# EAGLE design ledstringpower2 (EAGLE 9.2.2)
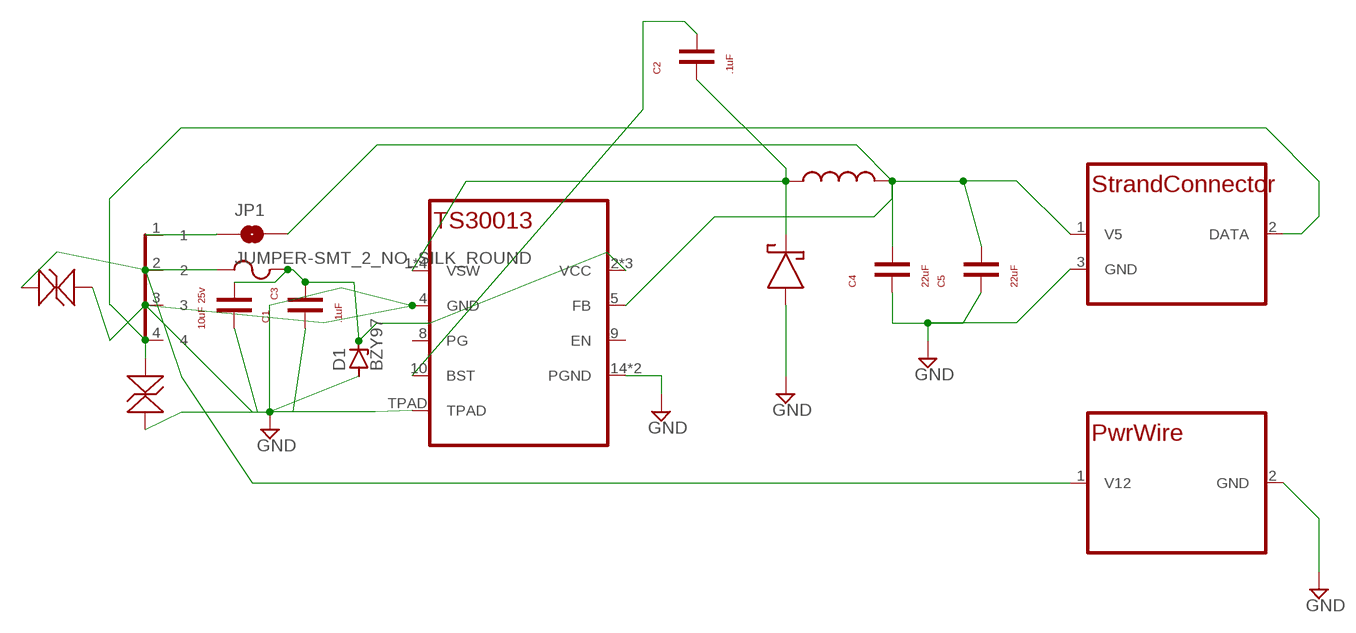
[diagram p0: schematic, sheet 1]

## Parts
C1  .1uF  CAPACITOR_NONPOLARC0603  [C0603]
C2  .1uF  CAPACITOR_NONPOLARC0603  [C0603]
C3  10uF 25v  CL31A106MAHNNNEC1206  [C1206]
C4  22uF  GRM188R61A226ME15DC0603  [C0603]
C5  22uF  GRM188R61A226ME15DC0603  [C0603]
D1  BZY97  [F126Z12]
D2  LS54LS54  [LS54]
F1  3A  FUSER0603  [R0603]
IC1  TS30013QFN16  [QFN16]
JP1  JUMPER-SMT_2_NO_SILK_ROUND  [SMT-JUMPER_2_NO_SILK_ROUND]
L1  SRN5040TA-4R7MSRN5040TA  [SRN5040TA]
TVS1  DESD5V0U1BL-7BDFN1006-2  [DFN1006-2]
TVS2  DESD5V0U1BL-7BDFN1006-2  [DFN1006-2]
U$3  TE-1969806-1TE-1969806-1  [TE-1969806-1]
U$5  LEDSTRANDDLEDWIREP  [LEDWIREP]
U$8  PWRWIREDPWRWIREP  [PWRWIREP]

## Nets
DATA: TVS2.2 U$3.4 U$5.2(DATA)
GND: C1.1 C3.2 C4.1 C5.1 D1.A D2.1 IC1.4(GND) IC1.14(PGND) IC1.15(PGND) IC1.TPAD TVS1.1 TVS2.1 U$3.3 U$5.3(GND) U$8.2(GND)
N$3: C2.1 D2.2 IC1.1(VSW) IC1.12(VSW) IC1.13(VSW) IC1.16(VSW) L1.1
N$5: C2.2 IC1.10(BST)
N$7: JP1.1 U$3.1
V5: C4.2 C5.2 IC1.5(FB) JP1.2 L1.2 U$5.1(V5)
V12: F1.1 TVS1.2 U$3.2 U$8.1(V12)
VCC: C1.2 C3.1 D1.C F1.2 IC1.2(VCC) IC1.3(VCC) IC1.11(VCC)
Unconnected: IC1.8(PG) IC1.9(EN)

## Library data of the parts
C1 C2 = ledinlinesupply:CAPACITOR_NONPOLAR
C3 = ledinlinesupply:CL31A106MAHNNNE
C4 C5 = ledinlinesupply:GRM188R61A226ME15D
D1 = diode:BZY97: Z DIODE
D2 = ledinlinesupply:LS54
F1 = ledinlinesupply:FUSE
IC1 = ledinlinesupply:TS30013
JP1 = SparkFun-Jumpers:JUMPER-SMT_2_NO: Normally open jumper This jumper has two pads in close proximity to each other. Apply solder to close the connection. Round pads are easier to solder for beginners, but are a lot larger. SparkFun Product that uses the round pads: SparkFun EL Sequencer <https://www.sparkfun.com/products/12781>
L1 = ledinlinesupply:SRN5040TA-4R7M
TVS1 TVS2 = ledinlinesupply:DESD5V0U1BL-7B
U$3 = ledinlinesupply:TE-1969806-1
U$5 = ledinlinesupply:LEDSTRANDD
U$8 = ledinlinesupply:PWRWIRED

## Board
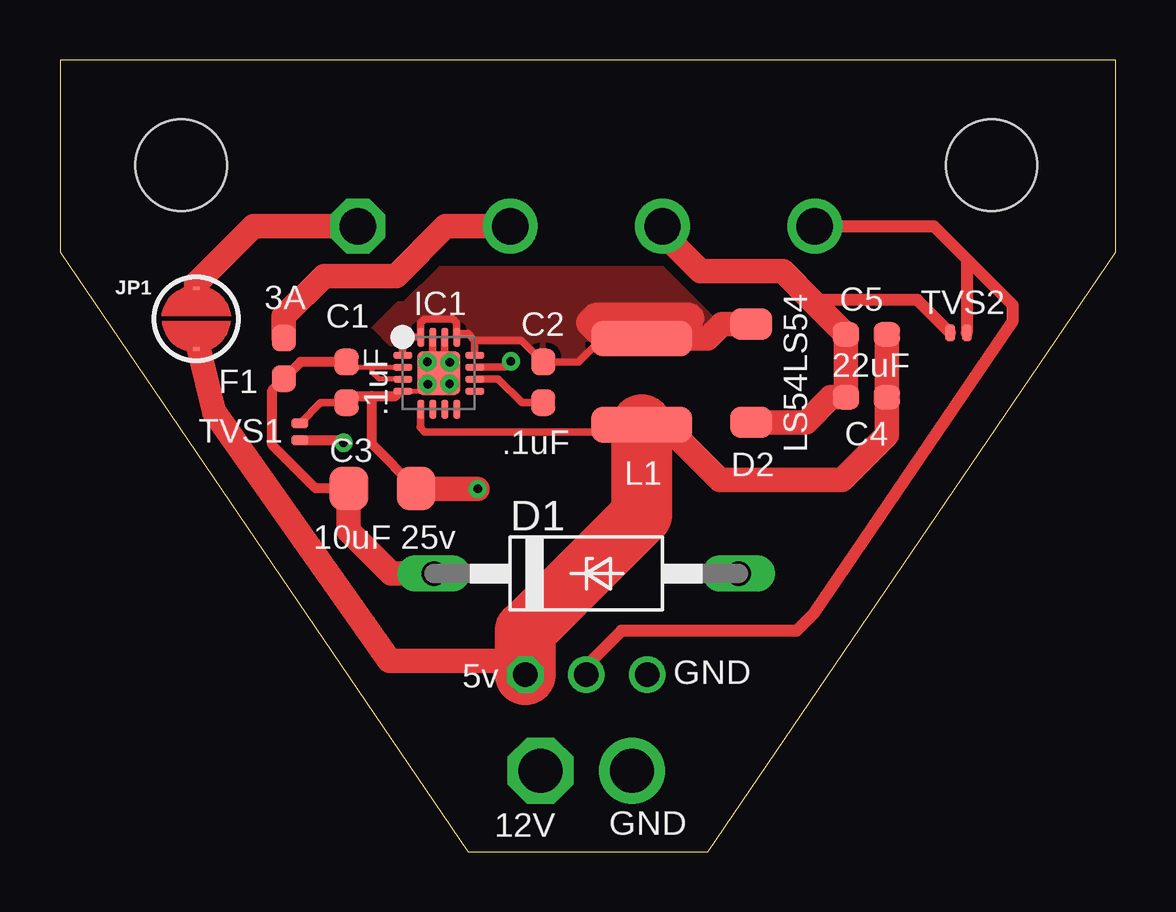
[diagram p1: board, top side]
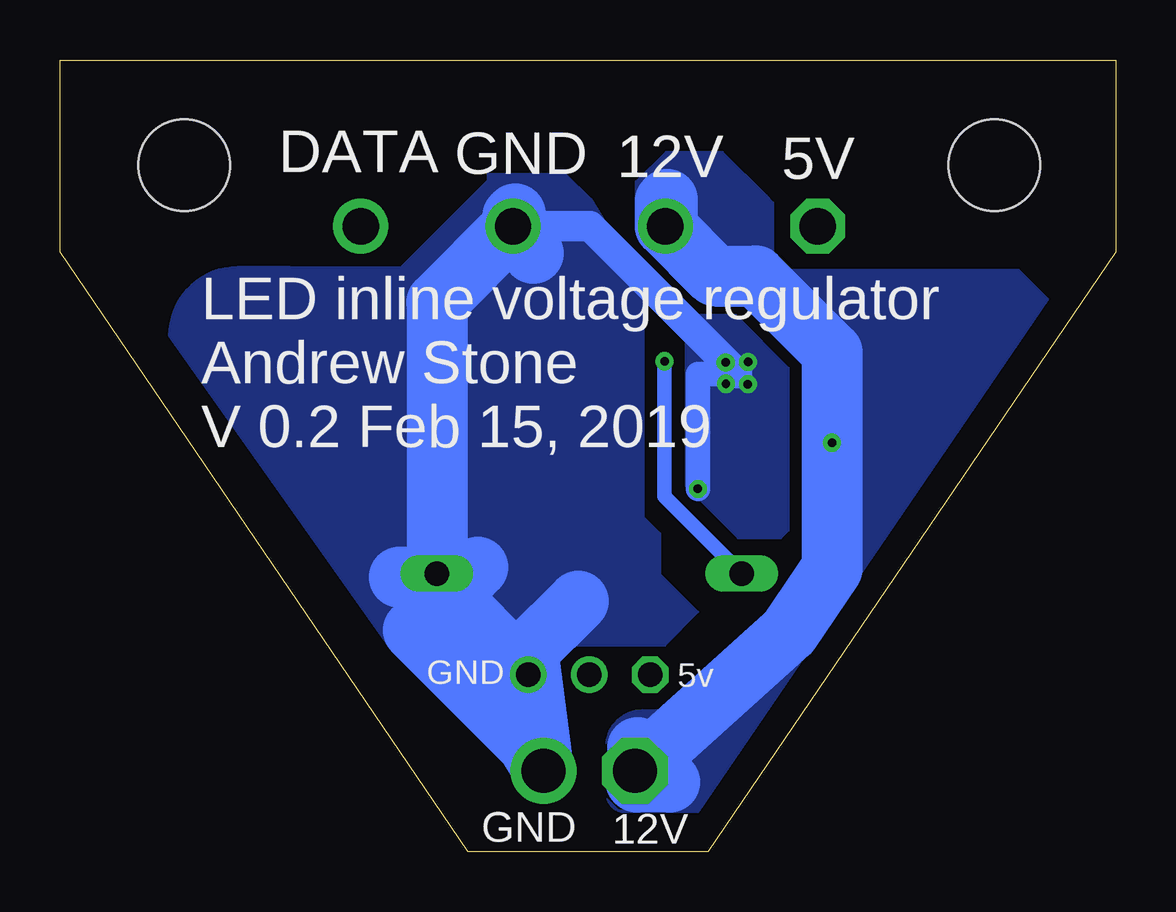
[diagram p2: board, bottom side, seen from below]

Size 44 x 33 mm. Coordinates in mm from the lower left corner, seen from the top.
Outline: 17,0 27,0 44,25 44,33 0,33 0,25 17,0
Copper layers (1*16): Top 0.035mm / dielectric 1.5mm / Bottom 0.035mm
Design rules "default *": minimum track width 6mil, minimum drill 0.35mm, track to track 6mil, track to pad 6mil, pad to pad 6mil, via to via 6mil, smd to smd 6mil, copper to edge 40mil, drill to drill 6mil, minimum pad ring 10mil, minimum via ring 8mil, stop-mask expansion 0.4mm, vias tented up to drill 0mil, thermal gap 10mil

### Footprints (pad centres in the part's own frame; a part is rotated, then mirrored left to right if it is on the bottom)
C0603 = smd 1.1 x 1: 1 -0.85,0; 2 0.85,0
C1206 = smd 1.6 x 1.8: 1 -1.4,0; 2 1.4,0
F126Z12 = drill 1.016 long: A 6.35,0; C -6.35,0
LS54 = smd 1.3 x 1.75: 1 -2.05,0; 2 2.05,0
R0603 = smd 1.1 x 1: 1 -0.85,0; 2 0.85,0
QFN16 = smd 0.8 x 0.3: 1 -1.5,0.75; 2 -1.5,0.25; 3 -1.5,-0.25; 4 -1.5,-0.75; 9 1.5,-0.75; 10 1.5,-0.25; 11 1.5,0.25; 12 1.5,0.75 | smd 0.3 x 0.8: 5 -0.75,-1.5; 6 -0.25,-1.5; 7 0.25,-1.5; 8 0.75,-1.5; 13 0.75,1.5; 14 0.25,1.5; 15 -0.25,1.5; 16 -0.75,1.5 | smd 1.8 x 1.8: TPAD 0,0
SMT-JUMPER_2_NO_SILK_ROUND = smd 0.152 x 0.305: 1 -1.27,0; 2 1.27,0
SRN5040TA = smd 1.5 x 4.2: 1 -1.8,0; 2 1.8,0
DFN1006-2 = smd 0.4 x 0.7: 1 -0.35,0; 2 0.35,0
TE-1969806-1 = drill 1.52 octagon: 1 -9.525,0 | drill 1.52: 2 -3.175,0; 3 3.175,0; 4 9.525,0 | hole 3.81: -16.89,2.54; 16.89,2.54
LEDWIREP = drill 1.016 octagon: 1 -2.54,0 | drill 1.016: 2 0,0; 3 2.54,0
PWRWIREP = drill 1.829 octagon: 1 -1.905,0 | drill 1.829: 2 1.905,0

### Placement (x,y rotation side)
C1  11.95,19.56 90 top
C2  20.14,19.56 270 top
C3  13.44,15.14 0 top
C4  33.62,18.94 0 top
C5  33.62,21.56 0 top
D1  21.94,11.59 0 top
D2  28.82,19.94 90 top
F1  9.33,20.56 270 top
IC1  15.79,19.94 0 top
JP1  5.68,22.21 270 top
L1  24.25,19.59 270 top
TVS1  10,17.5 270 top
TVS2  37.45,21.63 0 top
U$3  21.94,26.07 0 top
U$5  21.94,7.37 0 top
U$8  21.94,3.37 0 top

### Tracks (layer width: path | path; a pad name or v marks a point on that pad's centre or on a via)
DATA
  Top 0.508: U$3.4 36.43,26.07 37.8,24.7 | 37.8,24.7 TVS2.2 | 37.8,24.7 39.7,22.8 39.7,22.1 31.41,9.91 30.7,9.2 23.4,9.2 21.94,7.74 U$5.2
GND  (via drill 0.35)
  Top 0.2: 14,19 14.1,19 IC1.4 arc-90 IC1.4 15.3,19.2 arc90 15.79,19.69 15.79,19.9
  Top 0.305: C1.1 10.86,18.71 TVS1.1 | IC1.14 16.04,20.56 v16.25,20.39 | IC1.15 15.54,20.64 v15.32,20.41
  Top 0.406: C1.1 12.24,19 13,19 | 13,19 14,19 | C3.2 13,16.98 13,19 | IC1.TPAD 16.3,20.39 v16.25,20.39 | v16.24,19.5 15.84,19.9 15.79,19.9 | v15.33,19.49 v15.32,19.49 v15.32,20.41
  Top 0.508: 31.41,22.91 31.49,22.99 35.74,22.99 TVS2.1
  Top 1.016: D2.1 31.09,17.89 32.14,18.94 C4.1 C5.1 31.41,22.91 30.12,24.2 26.7,24.2 25.12,25.78 U$3.3 | v17.41,15.12 14.84,15.12 C3.2
  Bottom 0.406: v16.25,20.39 IC1.TPAD 15.33,19.53 v15.33,19.49 | v16.24,19.5 15.82,19.91 15.35,20.37 v15.32,20.41
  Bottom 1.016: 15.82,19.91 17.41,19.91 v17.41,15.12
  Bottom 1.27: IC1.TPAD 21.9,26.07 U$3.3
  Bottom 2.54: D1.A 28.29,22.9 U$3.3 25.12,26.48 25.02,26.58 25.02,25.68 24.27,24.93 | D1.A 28.29,11.18 U$5.3 U$8.2 | D1.A 26.86,11.59 | 26.86,11.59 26.59,11.86 | 26.86,11.59 27.02,11.43 29.85,11.43 | U$8.2 24.48,4.42 29.28,9.22 | U$8.2 24.48,8.34 22.39,10.43
  pour Bottom: 17.98,22.36 15.83,22.36 13.63,20.16 13.63,13.39 13.94,13.08 15.75,13.08 17.9,15.23 17.9,21.84 17.4,22.34 17.41,22.34
  pour Bottom: 19.68,23.6 19.68,13.94 19,13.26 19,11.58 17.4,9.98 18.79,8.59 30.31,8.59 39.44,21.51 arc90 36.59,24.36 34.43,24.36 arc-90 34.41,24.34 29.8,24.34 26.16,27.98 26.16,28.24 22.92,28.24 21.87,27.19
N$3
  Top 0.305: IC1.1 14.29,21.29 14.5,21.5 14.56,21.44 IC1.16 15.04,22.04 15.2,22.2 16.38,22.2 16.54,22.04 16.54,21.6 | 16.54,21.6 IC1.13 | IC1.12 17.29,21.31 | 16.54,21.6 17,21.6 17.29,21.31 | 17.29,21.31 19.24,21.31 C2.1 21.61,20.41 22.59,21.39 L1.1
  Top 1.016: D2.2 27.59,21.99 26.99,21.39 L1.1
  Top 1.27: L1.1 22.83,21.39 22.16,22.06 22.34,22.24 26.21,22.24
  pour Top: 14.18,21.04 13.83,21.04 13.03,21.84 14.07,22.88 14.33,22.88 15.82,24.37 25.13,24.37 27.26,22.24 27.26,22.04 26.72,21.5 22.57,21.5 21.53,20.46 20.12,20.46 19.33,21.25 19.11,21.25 19.04,21.32 17.22,21.32 16.28,22.26 15.32,22.26 14.96,21.9 14.96,21.56 14.8,21.4 14.32,21.4 14.23,21.31 14.23,21.17
N$5
  Top 0.305: C2.2 19.25,18.71 18.27,19.69 18,19.69 17.85,19.69 IC1.10
N$7
  Top 1.016: U$3.1 8.07,26.07 5.68,23.68 JP1.1
V5
  Top 0.152: JP1.2 5.77,20.98 | 18.27,9.71 19.4,9.2
  Top 0.305: IC1.5 15.04,17.74 15,17.7 15.2,17.5 23.96,17.5 L1.2
  Top 1.016: L1.2 25.21,17.79 27.5,15.5 32.6,15.5 34.47,17.36 C4.2 C5.2 | 5.77,20.98 6.43,18.33 13.74,7.94 18.83,7.94 arc-90 U$5.1
  Top 2.54: U$5.1 19.4,9.2 24.25,14.05 L1.2
V12  (via drill 0.35)
  Top 0.406: TVS1.2 11.71,17.15 v11.82,17.04
  Top 1.016: U$3.2 16.07,26.07 14,24 11,24 9.33,22.33 F1.1
  Bottom 2.54: U$3.2 16.7,24 15,24 11.82,20.82 v11.82,17.04 11.82,11.79 13.61,9.16 U$8.1 19.06,3.37 18.59,2.9 19.95,2.9 19.99,2.94 19.91,3.02 19.91,4.34 | U$3.2 18.77,27.1 18.68,27.19 18.68,26.16 U$3.2
  pour Bottom: 13.56,24.24 4.04,24.24 2.83,23.03 17.4,1.65 20.42,1.65 arc90 21.22,2.45 21.22,4.38 arc90 19.72,5.88 18.06,5.88 12.37,11.57 12.37,20.58 14.82,23.03
  pour Bottom: 19.99,26.31 19.99,27.92 18.75,29.16 16.38,29.16 14.56,27.34 14.28,27.06 14.28,24.46 14.42,24.32 18.21,24.32
VCC  (via drill 0.35)
  Top 0.2: C1.2 12.17,20.19 13,20.19 | 13,20.19 IC1.2 | IC1.3 13.31,19.69 13,20 13,20.19
  Top 0.305: IC1.11 18.55,20.19 v18.8,20.44
  Top 0.406: C1.2 10.03,20.41 F1.2 8.85,19.23 8.85,16.95 10.66,15.14 C3.1
  Top 1.016: C3.1 12.04,13.36 13.81,11.59 D1.C
  Bottom 0.61: v18.8,20.44 18.8,14.8 D1.C

### Text on the board
tPlace: 5v | GND | 12V | GND
bPlace: 5V | 12V | GND | DATA | LED inline voltage regulator / Andrew Stone / V 0.2 Feb 15, 2019 | 5v | GND | 12V | GND